# Altium schematic sheet 5_ESP_01.SchDoc
size A4; SheetNumber: 5; SheetTotal: 5
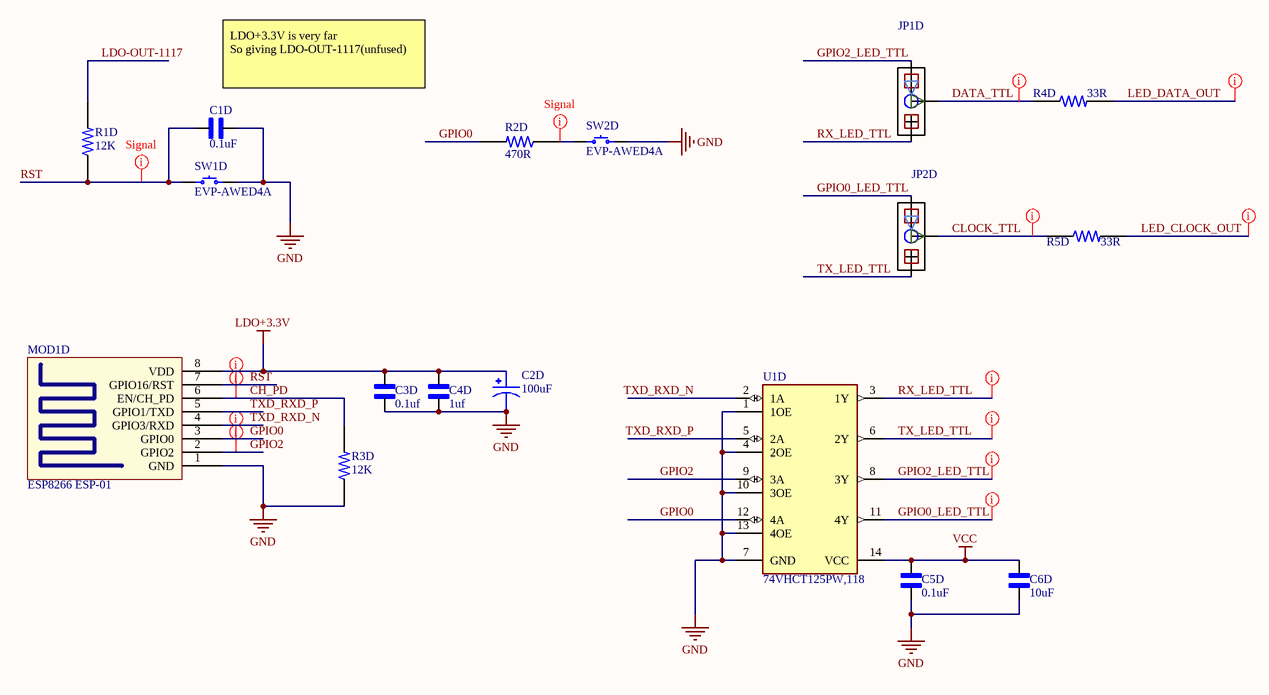
[diagram p0: 5_ESP_01.SchDoc]

## Parts
C1D  0.1uF  [C-0603]
C2D  100uF  [1411-3528]
C3D  0.1uf  [C-0603]
C4D  1uf  [C-0603]
C5D  0.1uF  [C-0603]
C6D  10uF  [C-0603]
JP1D  Solder Pad  [Solder_Pad_3_Pin_NC_Medium]  (value not drawn)
JP2D  Solder Pad  [Solder_Pad_3_Pin_NC_Medium]  (value not drawn)
MOD1D  ESP8266 ESP-01  [ESP8266 ESP-01]
R1D  12K  [R-0603]
R2D  470R  [R-0603]
R3D  12K  [R-0603]
R4D  33R  [R-0603]
R5D  33R  [R-0603]
SW1D  EVP-AWED4A  [PANASONIC EVPAW]
SW2D  EVP-AWED4A  [PANASONIC EVPAW]
U1D  74VHCT125PW,118  [SOP65P640X110-14N]

## Nets
GND: C1D.2 C2D.2 C3D.1 C4D.1 C5D.1 C6D.1 MOD1D.1(GND) R3D.1 SW1D.2 SW2D.2 U1D.1(1OE) U1D.4(2OE) U1D.7(GND) U1D.10(3OE) U1D.13(4OE)
LDO+3.3V: C2D.1 C3D.2 C4D.2 MOD1D.8(VDD)
VCC: C5D.2 C6D.2 U1D.14(VCC)
CH_PD: MOD1D.6(EN/CH_PD) R3D.2
CLOCK_TTL: JP2D.2 R5D.1
DATA_TTL: JP1D.2 R4D.1
GPIO0: MOD1D.3(GPIO0) R2D.2 U1D.12(4A)
GPIO0_LED_TTL: JP2D.1 U1D.11(4Y)
GPIO2: MOD1D.2(GPIO2) U1D.9(3A)
GPIO2_LED_TTL: JP1D.1 U1D.8(3Y)
LDO-OUT-1117: R1D.2
LED_CLOCK_OUT: R5D.2
LED_DATA_OUT: R4D.2
RST: C1D.1 MOD1D.7(GPIO16/RST) R1D.1 SW1D.1
RX_LED_TTL: JP1D.3 U1D.3(1Y)
TX_LED_TTL: JP2D.3 U1D.6(2Y)
TXD_RXD_N: MOD1D.4(GPIO3/RXD) U1D.2(1A)
TXD_RXD_P: MOD1D.5(GPIO1/TXD) U1D.5(2A)
NetR2D_1: R2D.1 SW2D.1

## Layout directives
net class Signal: CH_PD, CLOCK_TTL, DATA_TTL, GPIO0, GPIO0_LED_TTL, GPIO2, GPIO2_LED_TTL, LED_CLOCK_OUT, LED_DATA_OUT, NetR2D_1, RST, RX_LED_TTL, TX_LED_TTL

## Notes on the sheet
- (near C1D) LDO+3.3V is very far
  So giving LDO-OUT-1117(unfused)

## Library data of the parts
C1D C3D C4D C5D C6D = C-0603: Ceramic Capacitor 16V 0603 (1608 Metric); MP: C0603C104J4RAC; MF: KEMET; SnapEDA_Link: https://www.snapeda.com/parts/C0603C104J4RAC/KEMET/view-part/1763758/?ref=snap; Availability: Warning; Package: 0603 KEMET; Check_prices: https://www.snapeda.com/parts/C0603C104J4RAC/KEMET/view-part/1763758/?ref=eda; Value: *; Price: None
C2D = C-1411 (3528 Metric): Molded Tantalum Capacitors 16V 1411 (3528 Metric); MF: KEMET; MP: T495B106K025ATE750; Package: 1411 KEMET; Value: *; Availability: Unavailable; SnapEDA_Link: https://www.snapeda.com/parts/T495B106K025ATE750/KEMET/view-part/1680496/?ref=snap; Price: None
JP1D JP2D = Solder_Pad_3_Pin_NC_Medium: Solder Pad 3 Pin NC 1.016 mm Pitch
R1D R2D R3D R4D R5D = R-0603: 0603; MP: 2-1623703-0; Power_Rating: .1 W; Value: 10K; Tolerance: 1%; MF: TE Connectivity; Package: 0603; Price: None; Resistance: 10K; Check_prices: https://www.snapeda.com/parts/2-1623703-0/TE%20Connectivity/view-part/2213192/?ref=eda; SnapEDA_Link: https://www.snapeda.com/parts/2-1623703-0/TE%20Connectivity/view-part/2213192/?ref=snap; Availability: Warning
SW1D SW2D = EVP-AWED4A: 3.0MM X 2.0MM / 3.3N / 0.15MM ST; Manufacturer: Panasonic Electronic Components; Actuator Height off PCB, Vertical: 0.60mm; Actuator Orientation: Top Actuated; Actuator Type: Standard; Circuit: SPST-NO; Contact Rating @ Voltage: 0.02A @ 15VDC; Illumination: Non-Illuminated; Ingress Protection: IP67 - Dust Tight, Waterproof; Operating Force: 330gf; Outline: 3.00mm x 2.00mm; Switch Function: Off-Mom; Part Number: EVP-AWED4A; ComponentLink1Description: Datasheet; ComponentLink1URL: https://industrial.panasonic.com/ac/cdn/e/control/switch/light-touch/catalog/sw_lt_eng_3020s.pdf; ComponentLink2Description: DigiKey Link; ComponentLink2URL: https://www.digikey.com/en/products/detail/panasonic-electronic-components/EVP-AWED4A/8568275; LastUpdated: 29-12-2022 09:10:40 PM; Lifecycle Status: Active; Minimum Order: 1; Mounting Type: Surface Mount; Operating Temperature: -40°C ~ 85°C; Packaging: TapeAndReel; Part Status: Active; Price: 0.16; Series: EVPAW; Supplier 1: DigiKey; Supplier Part Number 1: P123440CT-ND; Termination Style: SMD (SMT) Tab
U1D = 74VHCT125PW,118: Buffer, Non-Inverting 4 Element 1 Bit per Element 3-State Output 14-SOIC; MP: 74HC125; MF: Nexperia USA; Value: *; SnapEDA_Link: https://www.snapeda.com/parts/74HC125/Nexperia%20USA%20Inc./view-part/560724/?ref=snap; Availability: Unavailable; Price: None; Package: SOIC-14 STMicroelectronics